# Altium schematic sheet dyno-side-schematic.SchDoc
size A
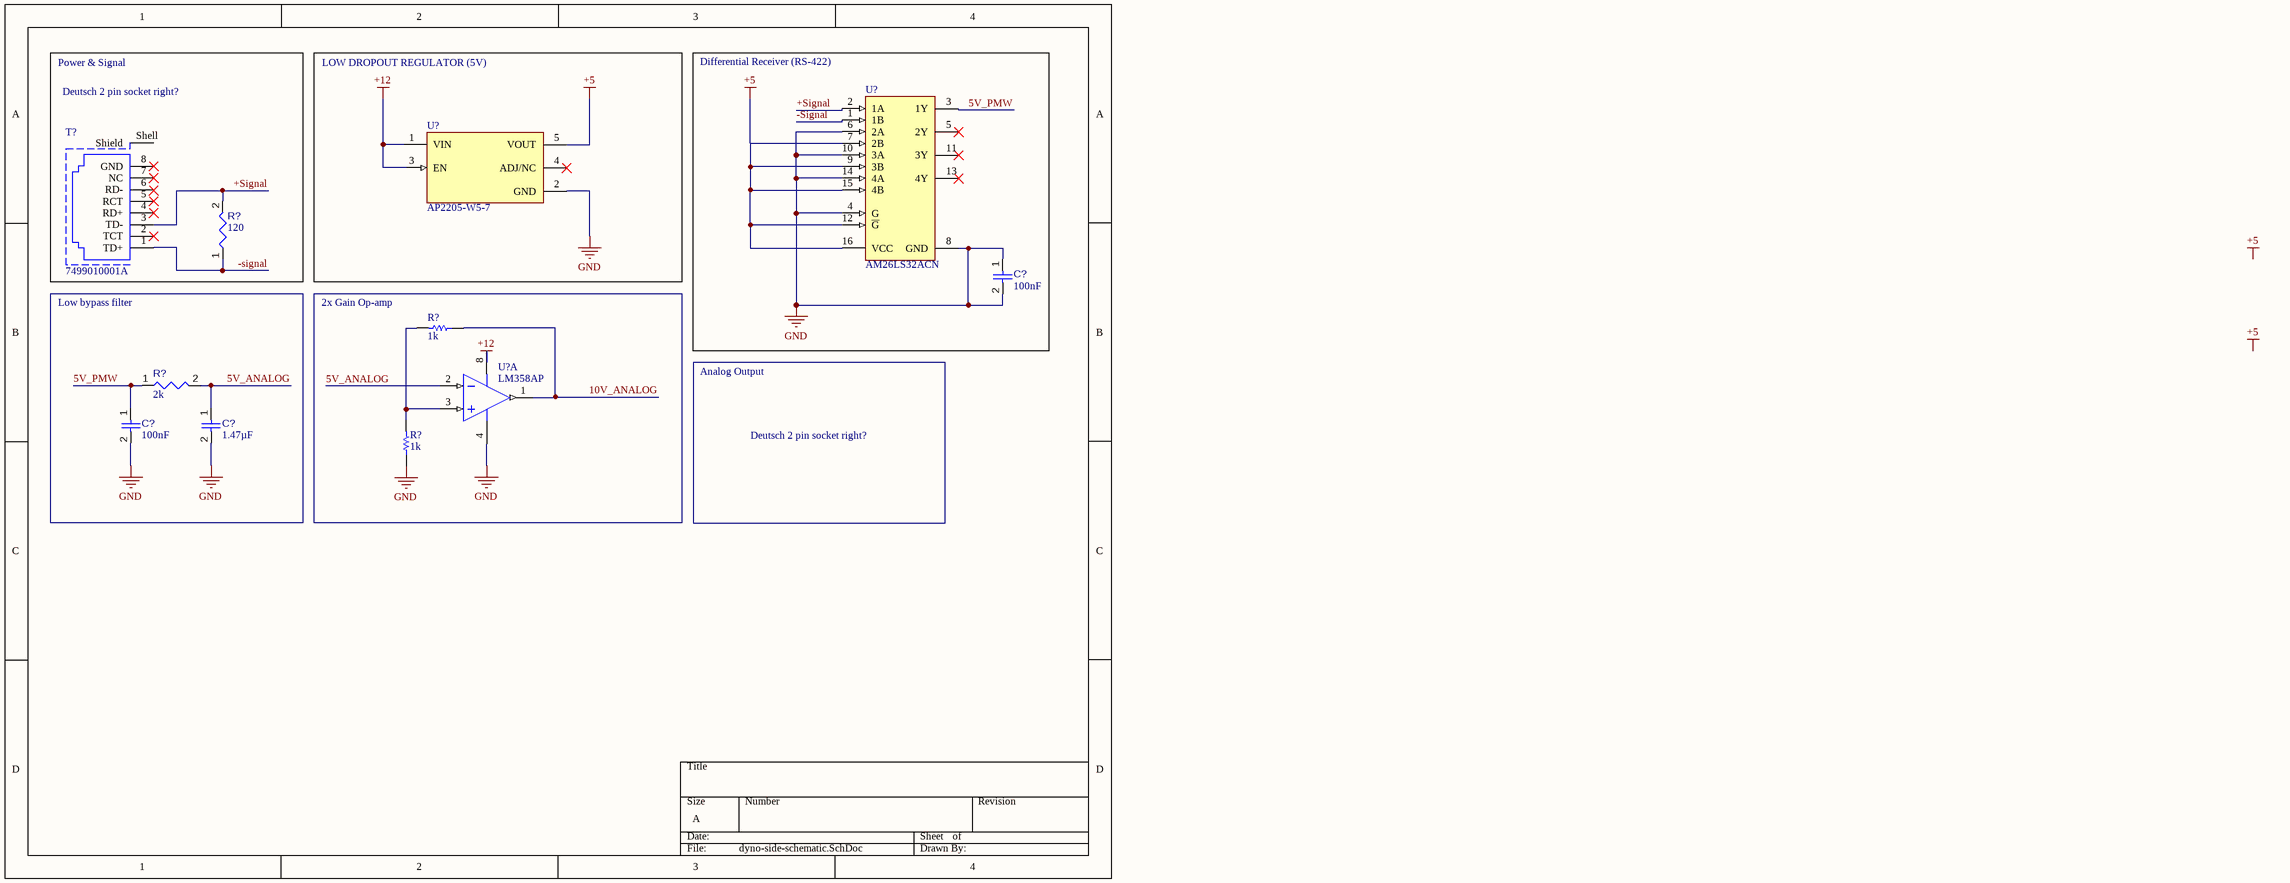
[diagram p0: dyno-side-schematic.SchDoc]

## Parts
(Parts that share a designator on the sheet are numbered #1, #2 ... from top to bottom, then left to right.)
C?#1  value 100nF  [CAPC0402(1005)60_L]  (hidden comment: Capacitor 100nF +/-20% 25V 0402)
C?#2  value 100nF  [CAPC0402(1005)60_L]  (hidden comment: Capacitor 100nF +/-20% 25V 0402)
C?#3  value 1.47µF  [CAPC2013X145X50ML20T25]  (hidden comment: Capacitor 1 uF +/- 10% 25 V 0805)
R?#1  value 120  [RESC0603(1608)_L]  (hidden comment: Resistor 120R +/-5 % 0603 0.1 W)
R?#2  value 1k  [RESC2013X70X40ML20T20]  (hidden comment: Resistor 1k +/-1% 0805 125 mW)
R?#3  value 2k  [RESC0402(1005)_L]  (hidden comment: Resistor 2K +/-5 % 0402 63 mW)
R?#4  value 1k  [RESC2013X70X40ML20T20]  (hidden comment: Resistor 1k +/-1% 0805 125 mW)
T?  7499010001A  [7499010001A]
U?#1  AM26LS32ACN  [N0016A]
U?#2  AP2205-W5-7  [FP-SOT25-IPC_B]
U?#3  LM358AP  [P0008A]  (part A of 2)

## Blocks framed on the sheet
LOW DROPOUT REGULATOR (5V): U?#2
Differential Receiver (RS-422): C?#1 U?#1

## Nets
+5: U?#1.7(2B) U?#1.9(3B) U?#1.12(~{G}) U?#1.15(4B) U?#1.16(VCC) U?#2.5(VOUT)
+12: U?#2.1(VIN) U?#2.3(EN) U?#3.8(VCC)
GND: C?#1.2 C?#2.2 C?#3.2 R?#4.1 U?#1.4(G) U?#1.6(2A) U?#1.8(GND) U?#1.10(3A) U?#1.14(4A) U?#2.2(GND) U?#3.4(GND)
5V_ANALOG: C?#3.1 R?#3.2 U?#3.2(1IN-)
5V_PMW: C?#2.1 R?#3.1 U?#1.3(1Y)
10V_ANALOG: R?#2.1 U?#3.1(1OUT)
+Signal: R?#1.2 T?.3(TD-) U?#1.2(1A)
-Signal: R?#1.1 T?.1(TD+) U?#1.1(1B)
NetR?#2_2: R?#2.2 R?#4.2 U?#3.3(1IN+)

Not connected (* = marked no-connect by the designer): C?#1 1; T? 2(TCT)* 4(RD+)* 5(RCT)* 6(RD-) 7(NC)* 8(GND)* Shell(Shield); U?#1 5(2Y)* 11(3Y)* 13(4Y)*; U?#2 4(ADJ/NC)*

## Notes on the sheet
- Power & Signal
- (near T?) Deutsch 2 pin socket right?
- Low bypass filter
- (near R?#2) 2x Gain Op-amp
- Analog Output
- Deutsch 2 pin socket right?
- Labels drawn without touching a wire or pin: +5

## Library data of the parts
C?#1 C?#2 = CMP-001-00065-4: Chip Capacitor, 100nF +/-20%, 25V, 0402, Thickness 0.6 mm; Tolerance: 10%; Max Operating Temperature: 85°C; Min Operating Temperature: -55°C; Pins: 2; Voltage Rating: 25V; Mounting Technology: SMT; Case/Package: 0402
C?#3 = CMP-001-00010-6: Chip Capacitor, 1 uF, +/-10%, 25 V, 0805 (2012 Metric); Capacitor Type: Ceramic; Voltage Rating: 25V; RoHS Compliant: True; Pins: 2; Mounting Technology: SM; Max Operating Temperature: 125°C; Min Operating Temperature: -55°C; Tolerance: 10%; Case/Package: 0805
R?#1 = CMP-009-00176-3: Chip Resistor, 120 Ohms, +/-5 %, 0.1 W, -55 to 155 degC, 0603; Power: 100mW; Tolerance: 5%; Max Operating Temperature: 155°C; Pins: 2; Case/Package: 0603; Min Operating Temperature: -55°C
R?#2 R?#4 = CMP-009-00010-5: Chip Resistor, 1 KOhm, +/- 1%, 0.125 W, -55 to 155 degC, 0805 (2013 Metric); Power: 125mW; Voltage Rating: 150V; Tolerance: 1%; RoHS Compliant: True; Mounting Technology: SM; Pins: 2; Case/Package: 0805; Max Operating Temperature: 155°C; Min Operating Temperature: -55°C
R?#3 = CMP-009-00138-3: Chip Resistor, 2 kOhms, +/-5 %, 63 mW, -55 to 155 degC, 0402; Tolerance: 5%; Power: 63mW; Max Operating Temperature: 155°C; Pins: 2; Min Operating Temperature: -55°C; Case/Package: 0402
T? = CMP-03913-27588258-2: 7499010001A RJ45 Connector Socket; Pitch: 2.54mm; Direction: Up; Number of Cores per Jack: 4; Inductance: 350µH; Connector Type: RJ45, Socket; Number of Positions: 8; Insertion Loss (dB): -1.2dB; Number of Ports: 1; Gender: Female; Color: Silver; Shielding: Shielded; Length: 25mm; NexarPartId: 27588258; Flammability Rating: UL94 V-0; Depth: 25.3mm; Housing Material: Thermoplastic; Height: 14mm; Termination: Solder; Contact Plating: Gold; Case/Package: Metal; RoHS: Compliant; Contact Material: Ferrite, Gold; Number of Rows: 1; Min Operating Temperature: 0°C; Lead Free: Lead Free; Mount: Cable, Through Hole; Max Operating Temperature: 70°C; Width: 16mm
U?#1 = CMP-0310-00097-2: Quadruple Differential Line Receiver, 0 TX / 4 RX, 0 to 70 degC, 16-Pin PDIP (N), Green (RoHS & no Sb/Br); Manufacturer: Texas Instruments; ICC(Max)(mA): 70; SubFamily: RS-422; Rating: Catalog; Receivers Per Package: 4; PackageVersion: revE, Dec-2002; Eco-Plan: Green (RoHS & no Sb/Br); Code_JEDEC: MS-001*; PartNumber: AM26LS32ACN; ComponentLink2URL: http://www.ti.com/lit/ml/mpdi002c/mpdi002c.pdf; # of TX/RX: 0 TX / 4 RX; ComponentLink1URL: http://www.ti.com/general/docs/lit/getliterature.tsp?genericPartNumber=AM26LS32AC&fileType=pdf; ComponentLink2Description: Package Specification; PackageDescription: 16-Pin Plastic Dual-In-Line Package, Row Spacing 7.62 mm, Pitch 2.54 mm; Mounting Technology: Through-hole; ComponentLink1Description: Datasheet; DatasheetVersion: SLLS115E; PackageReference: N0016A
U?#2 = CMP-12756-000046-1: IC REG LIN POS ADJ 250MA SOT25
U?#3 = CMP-1685-00017-1: Dual Operational Amplifier, 3 to 32 V, 0 to 70 degC, 8-Pin PDIP (P), Pb-Free (RoHS), Tube; Case\Package: 0603; Luminous Intensity: 90 mcd; Viewing Angle: 130 degrees; Nominal Vf: 2 V; Lens Style: Diffused; Illumination Colour: Orange; Power Rating: 75 mW; Forward Current: 20 mA; Pins: 2; ComponentLink3Description: Package Specification; Packaging: Tape and Reel; Mount: Surface Mount; PackageReference: P0008A; Radiation Hardening: No; ComponentLink3URL: http://www.ti.com/lit/ml/mpdi001b/mpdi001b.pdf; Case Code (Metric): 1608; ComponentLink2Description: Datasheet; Max Operating Temperature: 85 degC; ComponentLink1Description: Manufacturer URL; RoHSCompliant: true; Width: 0.8 mm; Length: 1.6 mm; DatasheetVersion: SLOS068T, 04/2015; Min Operating Temperature: -55 degC; Height: 1.1 mm; Colour: Orange; ComponentLink2URL: http://www.ti.com/lit/ds/symlink/lm358a.pdf; PackageDescription: 8-Pin Double In-line Package, Body 9.59 x 6.35 mm, Pitch 2.54 mm; PackageVersion: 4040082/E, 04/2010; Forward Voltage: 2 V; Package Quantity: 3000; Case Code (Imperial): 0603; ComponentLink1URL: http://www.ti.com/